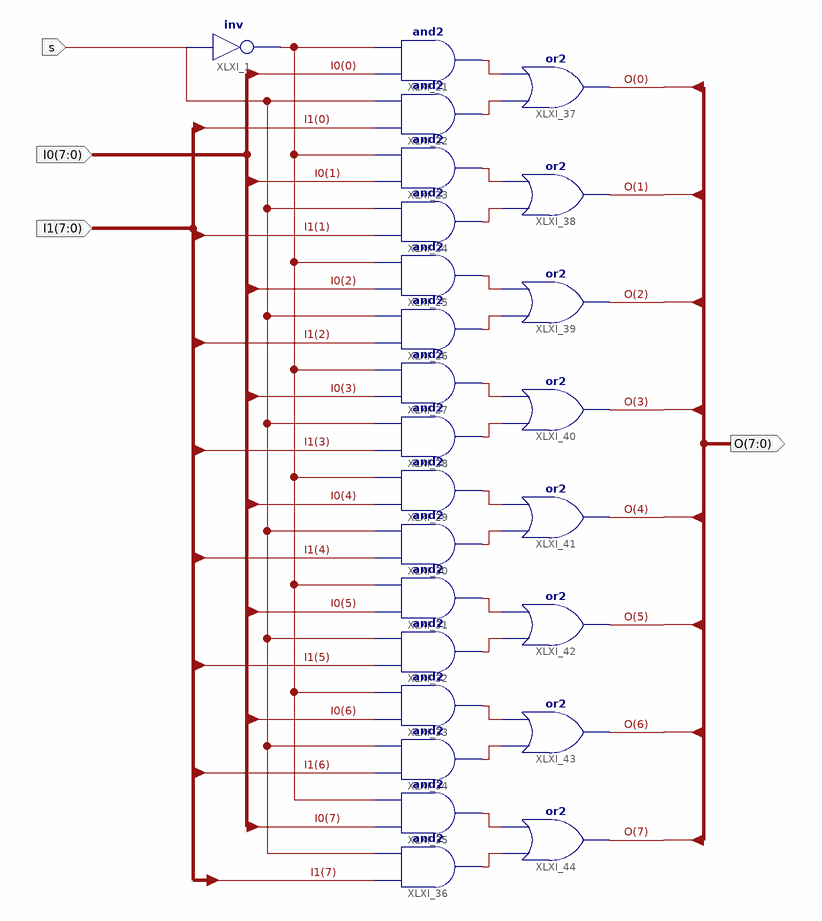
[diagram p0: schematic sheet 1]
// Xilinx ISE schematic MUX2T1_8.sch (kintex7) as structural Verilog: 25 symbols, 4 ports
module MUX2T1_8 (
  input  s,
  input  [7:0] I0,
  input  [7:0] I1,
  output [7:0] O
);

  wire XLXN_41, XLXN_59, XLXN_60, XLXN_61, XLXN_62, XLXN_63, XLXN_64, XLXN_65, XLXN_66, XLXN_67, XLXN_68,
       XLXN_69, XLXN_70, XLXN_71, XLXN_72, XLXN_73, XLXN_74;

  not XLXI_1 (XLXN_41, s);
  and XLXI_21 (XLXN_59, I0[0], XLXN_41);
  and XLXI_22 (XLXN_60, I1[0], s);
  and XLXI_23 (XLXN_61, I0[1], XLXN_41);
  and XLXI_24 (XLXN_62, I1[1], s);
  and XLXI_25 (XLXN_63, I0[2], XLXN_41);
  and XLXI_26 (XLXN_64, I1[2], s);
  and XLXI_27 (XLXN_65, I0[3], XLXN_41);
  and XLXI_28 (XLXN_66, I1[3], s);
  and XLXI_29 (XLXN_67, I0[4], XLXN_41);
  and XLXI_30 (XLXN_68, I1[4], s);
  and XLXI_31 (XLXN_69, I0[5], XLXN_41);
  and XLXI_32 (XLXN_70, I1[5], s);
  and XLXI_33 (XLXN_71, I0[6], XLXN_41);
  and XLXI_34 (XLXN_72, I1[6], s);
  and XLXI_35 (XLXN_73, I0[7], XLXN_41);
  and XLXI_36 (XLXN_74, I1[7], s);
  or XLXI_37 (O[0], XLXN_60, XLXN_59);
  or XLXI_38 (O[1], XLXN_62, XLXN_61);
  or XLXI_39 (O[2], XLXN_64, XLXN_63);
  or XLXI_40 (O[3], XLXN_66, XLXN_65);
  or XLXI_41 (O[4], XLXN_68, XLXN_67);
  or XLXI_42 (O[5], XLXN_70, XLXN_69);
  or XLXI_43 (O[6], XLXN_72, XLXN_71);
  or XLXI_44 (O[7], XLXN_74, XLXN_73);
endmodule
